# EasyEDA Pro project ProPrj_NavBot-ChargeModule-2S_2026-01-14.epro

# Schematic RECHARGE

## Sheets
1 version: Assembly Variant: Basic; Board Name: RECHARGE; Create Date: 2025-10-13; Page Name: version; Project Name: NavBot-ChargeModule-2S; Schematic Name: RECHARGE; Update Date: 2025-10-13; BladeWidth: 10; Company: NavBot; Drawed: Xioale; Page Size: A4; RegionStart: 1; Reviewed: Xiaole; ShowBorder: 1; TitleBlock: 1; TitleBlockPosition: 3; Version: V1.0; XRegionCount: 6; YRegionCount: 4
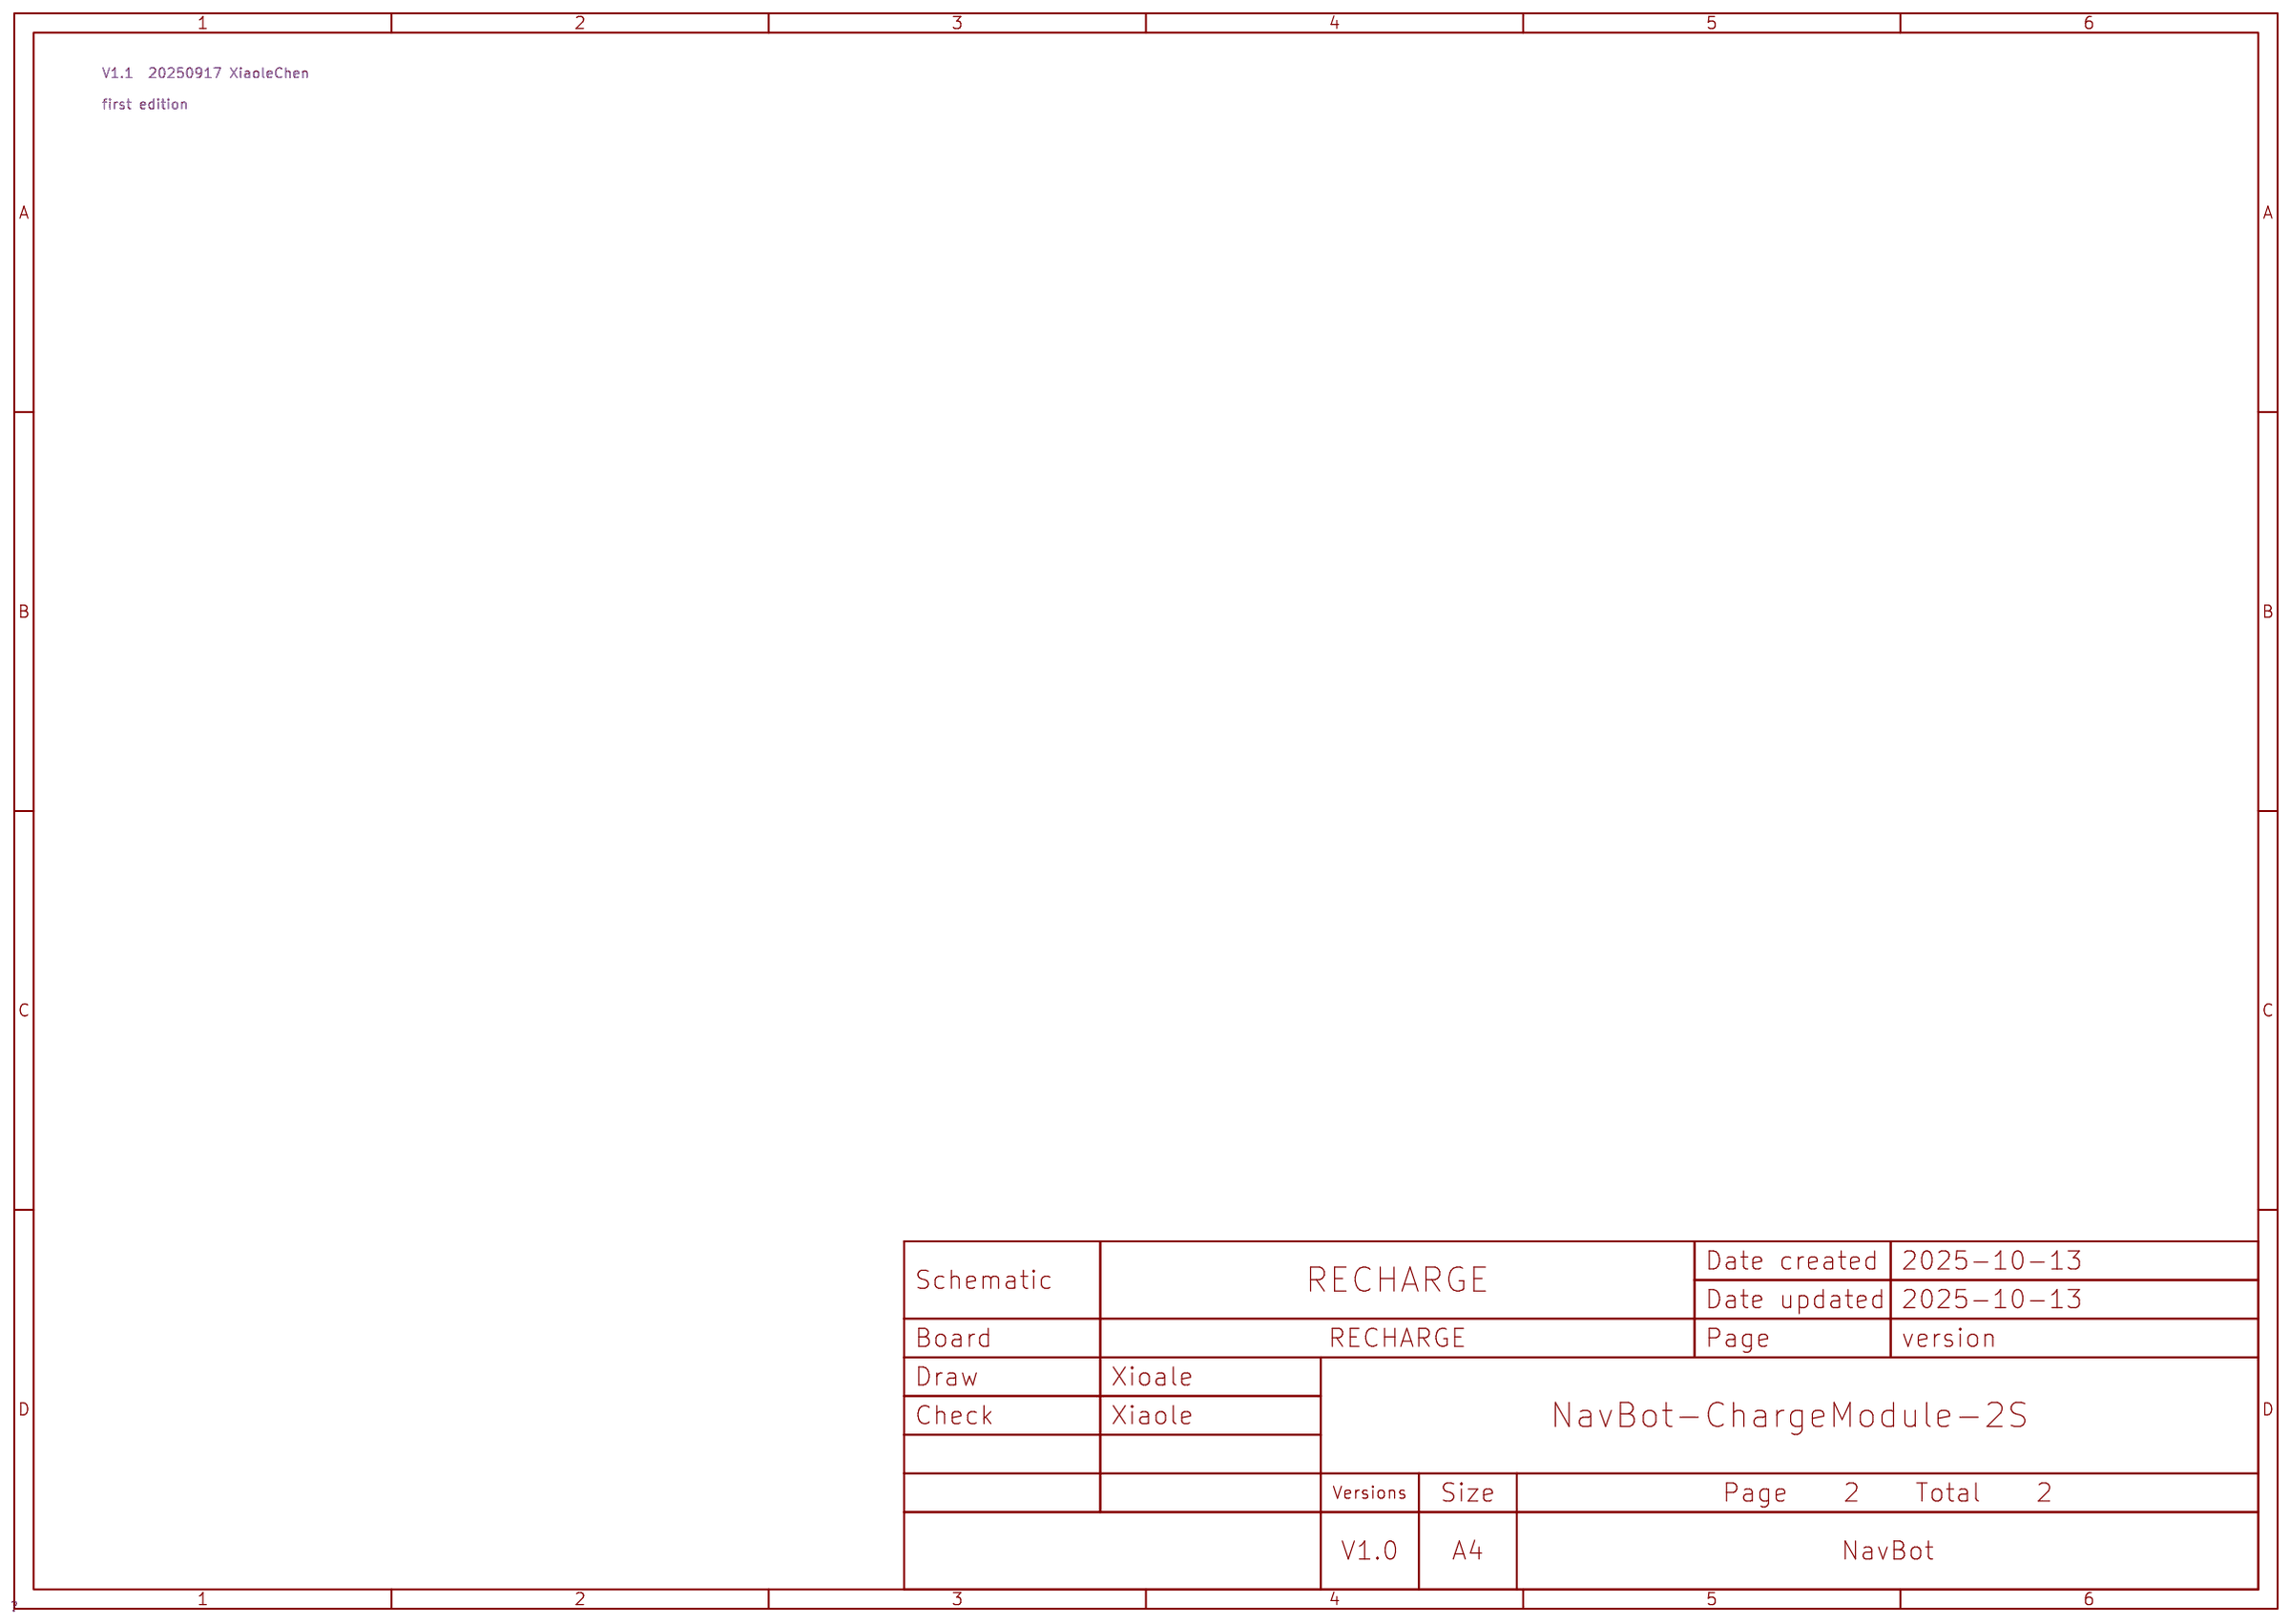
[diagram p0: version]
2 P1: Page Name: P1
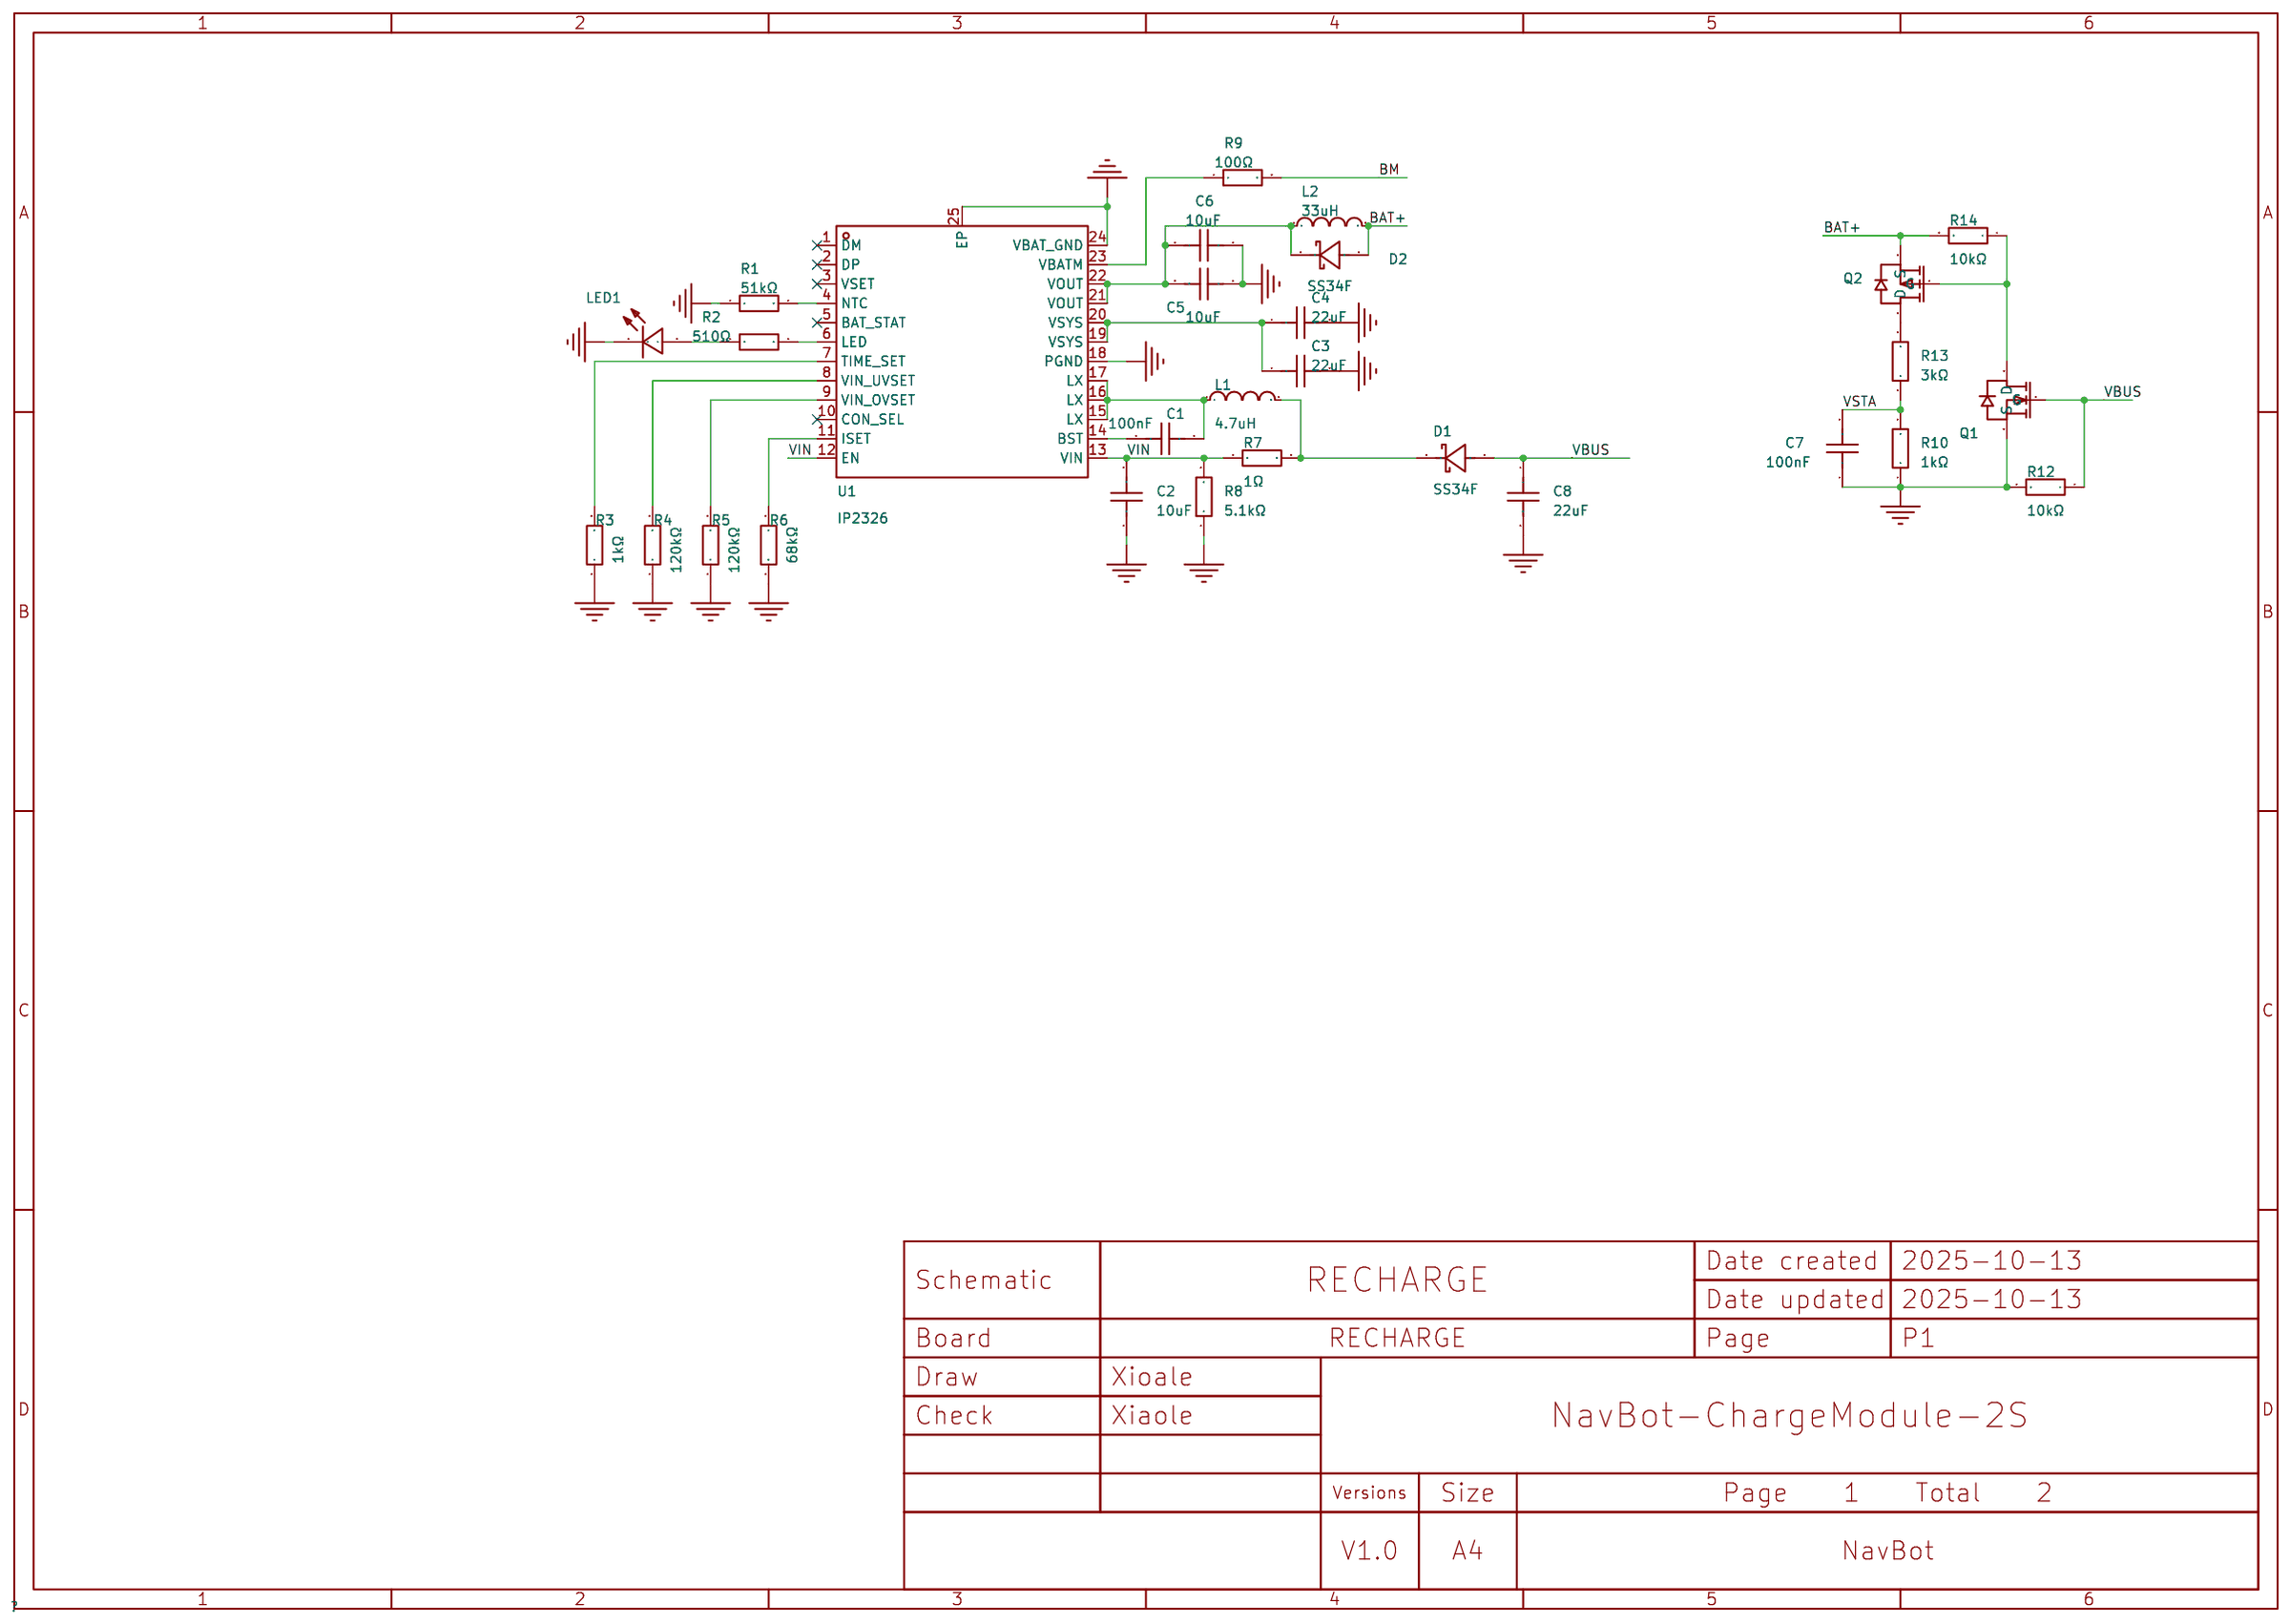
[diagram p1: P1]

## Parts
C1  100nF  [C0603]
C2  10uF  [C0603]
C3  22uF  [C0805]
C4  22uF  [C0805]
C5  10uF  [C0603]
C6  10uF  [C0603]
C7  100nF  [C0603]
C8  22uF  [C0805]
D1  SS34F  [SMAF_L3.5-W2.6-LS4.7-RD-1]
D2  SS34F  [SMAF_L3.5-W2.6-LS4.7-RD-1]
L1  4.7uH  [IND-SMD_L4.0-W4.0]
L2  33uH  [IND-SMD_L4.0-W4.0]
LED1  KT-0603R  [LED0603-RD]
Q1  -  [SOT-23-3_L2.9-W1.3-P1.90-LS2.4-BR]
Q2  -  [AO3401A_SOT-23-3]
R1  51kΩ  [R0603]
R2  510Ω  [R0603]
R3  1kΩ  [R0603]
R4  120kΩ  [R0603]
R5  120kΩ  [R0603]
R6  68kΩ  [R0603]
R7  1Ω  [R0603]
R8  5.1kΩ  [R0603]
R9  100Ω  [R1206]
R10  1kΩ  [R0603]
R12  10kΩ  [R0603]
R13  3kΩ  [R0603]
R14  10kΩ  [R0603]
U1  IP2326  [VQFN-24_L4.0-W4.0-P0.50-BL-EP2.5]

## Library data of the parts
C1 C7 = CC0603KRX7R9BB104: 容值:100nF;精度:±10%;额定电压:50V;材质(温度系数):X7R;; LCSC Part Name: 100nF ±10% 50V; Supplier Part: C14663; Manufacturer: YAGEO(国巨); Supplier Footprint: 0603; JLCPCB Part Class: 基础库; Datasheet: https://atta.szlcsc.com/upload/public/pdf/source/20180910/C282072_33301C7F631E79921B82A8DAC6BCC5B3.pdf; Supplier: LCSC; Tolerance: ±10%; Voltage Rated: 50V; Temperature Coefficient: X7R
C2 C5 C6 = CL10A106MA8NRNC: 容值:10uF;精度:±20%;额定电压:25V;温度系数:X5R;; LCSC Part Name: 10uF ±20% 25V; Supplier Part: C96446; Manufacturer: SAMSUNG(三星); Supplier Footprint: 0603; JLCPCB Part Class: 基础库; Datasheet: https://item.szlcsc.com/datasheet/CL10A106MA8NRNC/97651.html; Supplier: LCSC; Tolerance: ±20%; Voltage Rating: 25V; Temperature Coefficient: X5R
C3 C4 C8 = CL21A226MAQNNNE: 容值:22uF;精度:±20%;额定电压:25V;材质(温度系数):X5R;; LCSC Part Name: 22uF ±20% 25V; Supplier Part: C45783; Manufacturer: SAMSUNG(三星); Supplier Footprint: 0805; JLCPCB Part Class: 基础库; Datasheet: https://atta.szlcsc.com/upload/public/pdf/source/20160218/1457707763339.pdf; Supplier: LCSC; Tolerance: ±20%; Voltage Rated: 25V; Temperature Coefficient: X5R
D1 D2 = SS34F_C18199199: 二极管配置:独立式;正向压降(Vf):550mV@3.0A;直流反向耐压(Vr):40V;整流电流:3A;; LCSC Part Name: 电压:40V 电流:3A; Supplier Part: C18199199; Manufacturer: R+O(宏嘉诚); Supplier Footprint: SMAF; JLCPCB Part Class: 扩展库; Datasheet: https://item.szlcsc.com/datasheet/SS34F/19354431.html; Supplier: LCSC; Diode Configuration: 独立式; Voltage - Forward(Vf@If): 550mV@3.0A; Voltage - DC Reverse(Vr): 40V; Current - Rectified: 3A; Reverse Leakage Current (Ir): 200uA@40V; Operating Junction Temperature Range: -55℃~+125℃; Non-Repetitive Peak Forward Surge Current: 80A
L1 = FHD4012S-4R7MT: 电感值:4.7uH;精度:±20%;额定电流:2.1A;饱和电流(Isat):2.6A;类型:-;; LCSC Part Name: 4.7uH ±20% 2.6A; Supplier Part: C602022; Manufacturer: cjiang(长江微电); Supplier Footprint: SMD,4x4mm; JLCPCB Part Class: 扩展库; Datasheet: https://item.szlcsc.com/datasheet/FHD4012S-4R7MT/631452.html; Supplier: LCSC; Tolerance: ±20%; Current Rating: 2.1A; Current - Saturation(Isat): 2.6A; DC Resistance(DCR): 145mΩ
L2 = FHD4020S-330MT: 电感值:33uH;精度:±20%;额定电流:860mA;饱和电流(Isat):1.4A;类型:绕线电感;; LCSC Part Name: 33uH ±20% 1.4A; Supplier Part: C602034; Manufacturer: cjiang(长江微电); Supplier Footprint: SMD,4x4mm; JLCPCB Part Class: 扩展库; Datasheet: https://atta.szlcsc.com/upload/public/pdf/source/20200609/C601990_BCEA243EC4DA0A9A288AA78A6DFB48A5.pdf; Supplier: LCSC; Tolerance: ±20%; Current Rating: 860mA; Current - Saturation(Isat): 1.4A; DC Resistance(DCR): 650mΩ; Type: 绕线电感
LED1 = KT-0603R: 发光颜色:红色;功率:-;正向电流:-;主波长:-;二极管配置:-;透镜颜色:-;色温:-;发光角度:-;载带方式:-;工作温度:-40℃~+85℃;; LCSC Part Name: 0603 红灯 高亮; Supplier Part: C2286; Manufacturer: KENTO; Supplier Footprint: 0603; JLCPCB Part Class: 基础库; Datasheet: https://atta.szlcsc.com/upload/public/pdf/source/20160616/1466072038404.pdf; Supplier: LCSC; Emitted Color: 红色; Operating Temperature: -40℃~+85℃
Q1 = AO3400A_N: 类型:N沟道;漏源电压(Vdss):30V;连续漏极电流(Id):5.2A;功率(Pd):1W;导通电阻(RDS(on)@Vgs,Id):35mΩ@10V,5A;阈值电压(Vgs(th)@Id):1.5V@250μA;; Supplier Footprint: SOT-23; Supplier Part: C700953
Q2 = AO3401A_P: Supplier Footprint: SOT-23-3L; Supplier Part: C15127
R1 = 0603WAF5102T5E: 电阻类型:厚膜电阻;阻值:51kΩ;精度:±1%;功率:100mW;最大工作电压:75V;温度系数:±100ppm/℃;; LCSC Part Name: 51kΩ ±1% 100mW 厚膜电阻; Supplier Part: C23196; Manufacturer: UNI-ROYAL(厚声); Supplier Footprint: 0603; JLCPCB Part Class: 基础库; Datasheet: https://atta.szlcsc.com/upload/public/pdf/source/20200306/C422600_1E6D84923E4A46A82E41ADD87F860B5C.pdf; Supplier: LCSC; Type: 厚膜电阻; Tolerance: ±1%; Power(Watts): 100mW; Overload Voltage (Max): 75V; Temperature Coefficient: ±100ppm/℃; Operating Temperature Range: -55℃~+155℃
R2 = 0603WAF5100T5E: 电阻类型:厚膜电阻;阻值:510Ω;精度:±1%;功率:100mW;工作电压:75V;温度系数:±100ppm/℃;; LCSC Part Name: 510Ω ±1% 100mW 厚膜电阻; Supplier Part: C23193; Manufacturer: UNI-ROYAL(厚声); Supplier Footprint: 0603; JLCPCB Part Class: 基础库; Datasheet: https://item.szlcsc.com/datasheet/0603WAF5100T5E/23920.html; Supplier: LCSC; Type: 厚膜电阻; Tolerance: ±1%; Power(Watts): 100mW; Voltage-Supply(Max): 75V; Temperature Coefficient: ±100ppm/℃; Operating Temperature: -55℃~+155℃
R3 R10 = 0603WAF1001T5E: 电阻类型:厚膜电阻;阻值:1kΩ;精度:±1%;功率:100mW;最大工作电压:75V;温度系数:±100ppm/℃;; LCSC Part Name: 1kΩ ±1% 100mW 厚膜电阻; Supplier Part: C21190; Manufacturer: UNI-ROYAL(厚声); Supplier Footprint: 0603; JLCPCB Part Class: 基础库; Datasheet: https://atta.szlcsc.com/upload/public/pdf/source/20200306/C422600_1E6D84923E4A46A82E41ADD87F860B5C.pdf; Supplier: LCSC; Type: 厚膜电阻; Tolerance: ±1%; Power(Watts): 100mW; Overload Voltage (Max): 75V; Temperature Coefficient: ±100ppm/℃; Operating Temperature Range: -55℃~+155℃
R4 R5 = 0603WAF1203T5E: 电阻类型:厚膜电阻;阻值:120kΩ;精度:±1%;功率:100mW;工作电压:75V;温度系数:±100ppm/℃;; LCSC Part Name: 120kΩ ±1% 100mW 厚膜电阻; Supplier Part: C25808; Manufacturer: UNI-ROYAL(厚声); Supplier Footprint: 0603; JLCPCB Part Class: 基础库; Datasheet: https://item.szlcsc.com/datasheet/0603WAF1203T5E/26551.html; Supplier: LCSC; Type: 厚膜电阻; Tolerance: ±1%; Power(Watts): 100mW; Voltage-Supply(Max): 75V; Temperature Coefficient: ±100ppm/℃; Operating Temperature: -55℃~+155℃
R6 = 0603WAF6802T5E: 电阻类型:厚膜电阻;阻值:68kΩ;精度:±1%;功率:100mW;工作电压:75V;温度系数:±100ppm/℃;; LCSC Part Name: 68kΩ ±1% 100mW 厚膜电阻; Supplier Part: C23231; Manufacturer: UNI-ROYAL(厚声); Supplier Footprint: 0603; JLCPCB Part Class: 基础库; Datasheet: https://item.szlcsc.com/datasheet/0603WAF6802T5E/23958.html; Supplier: LCSC; Type: 厚膜电阻; Tolerance: ±1%; Power(Watts): 100mW; Voltage-Supply(Max): 75V; Temperature Coefficient: ±100ppm/℃; Operating Temperature: -55℃~+155℃
R7 = 0603WAF100KT5E: 电阻类型:厚膜电阻;阻值:1Ω;精度:±1%;功率:100mW;工作电压:75V;温度系数:±400ppm/℃;; LCSC Part Name: 1Ω ±1% 100mW 厚膜电阻; Supplier Part: C22936; Manufacturer: UNI-ROYAL(厚声); Supplier Footprint: 0603; JLCPCB Part Class: 基础库; Datasheet: https://item.szlcsc.com/datasheet/0603WAF100KT5E/23663.html; Supplier: LCSC; Type: 厚膜电阻; Tolerance: ±1%; Power(Watts): 100mW; Voltage-Supply(Max): 75V; Temperature Coefficient: ±400ppm/℃; Operating Temperature: -55℃~+155℃
R8 = 0603WAF5101T5E: 电阻类型:厚膜电阻;阻值:5.1kΩ;精度:±1%;功率:100mW;最大工作电压:75V;温度系数:±100ppm/℃;; LCSC Part Name: 5.1kΩ ±1% 100mW 厚膜电阻; Supplier Part: C23186; Manufacturer: UNI-ROYAL(厚声); Supplier Footprint: 0603; JLCPCB Part Class: 基础库; Datasheet: https://atta.szlcsc.com/upload/public/pdf/source/20200306/C422600_1E6D84923E4A46A82E41ADD87F860B5C.pdf; Supplier: LCSC; Type: 厚膜电阻; Tolerance: ±1%; Power(Watts): 100mW; Overload Voltage (Max): 75V; Temperature Coefficient: ±100ppm/℃; Operating Temperature Range: -55℃~+155℃
R9 = 1206W4F1000T5E: 电阻类型:厚膜电阻;阻值:100Ω;精度:±1%;功率:250mW;工作电压:200V;温度系数:±100ppm/℃;; LCSC Part Name: 100Ω ±1% 250mW 厚膜电阻; Supplier Part: C17901; Manufacturer: UNI-ROYAL(厚声); Supplier Footprint: 1206; JLCPCB Part Class: 基础库; Datasheet: https://item.szlcsc.com/datasheet/1206W4F1000T5E/18589.html; Supplier: LCSC; Type: 厚膜电阻; Tolerance: ±1%; Power(Watts): 250mW; Voltage-Supply(Max): 200V; Temperature Coefficient: ±100ppm/℃; Operating Temperature: -55℃~+155℃
R12 R14 = 0603WAF1002T5E: 电阻类型:厚膜电阻;阻值:10kΩ;精度:±1%;功率:100mW;最大工作电压:75V;温度系数:±100ppm/℃;; LCSC Part Name: 厚膜电阻 10kΩ ±1% 100mW; Supplier Part: C25804; Manufacturer: UNI-ROYAL(厚声); Supplier Footprint: 0603; JLCPCB Part Class: 基础库; Datasheet: https://atta.szlcsc.com/upload/public/pdf/source/20200306/C422600_1E6D84923E4A46A82E41ADD87F860B5C.pdf; Supplier: LCSC; Type: 厚膜电阻; Tolerance: ±1%; Power(Watts): 100mW; Overload Voltage (Max): 75V; Temperature Coefficient: ±100ppm/℃; Operating Temperature Range: -55℃~+155℃
R13 = 0603WAF3001T5E: 电阻类型:厚膜电阻;阻值:3kΩ;精度:±1%;功率:100mW;工作电压:75V;温度系数:±100ppm/℃;; LCSC Part Name: 3kΩ ±1% 100mW 厚膜电阻; Supplier Part: C4211; Manufacturer: UNI-ROYAL(厚声); Supplier Footprint: 0603; JLCPCB Part Class: 基础库; Datasheet: https://atta.szlcsc.com/upload/public/pdf/source/20200306/C422600_1E6D84923E4A46A82E41ADD87F860B5C.pdf; Supplier: LCSC; Type: 厚膜电阻; Tolerance: ±1%; Power(Watts): 100mW; Voltage-Supply(Max): 75V; Temperature Coefficient: ±100ppm/℃; Operating Temperature: -55℃~+155℃
U1 = IP2326: 工作电压:4.5V~9.5V;最大充电电流:1.5A;电池类型:锂离子/聚合物;电池节数:2~3;; LCSC Part Name: 支持15W快充的2节/3节串联锂电池升压充电IC; Supplier Part: C2832094; Manufacturer: INJOINIC(英集芯); Supplier Footprint: VQFN-24-EP(4x4); JLCPCB Part Class: 扩展库; Datasheet: https://item.szlcsc.com/datasheet/IP2326/2988389.html; Supplier: LCSC; The Chip Type: 充电芯片；均衡芯片; Voltage - Supply: 4.5V~9.5V; Charge Current - Max: 1.5A; Charging Saturation Voltage: 8.4V; Type of Battery: 锂离子/聚合物; Number of Cells: 2~3; Operating Temperature: -40℃~+150℃; Battery Temperature Detection: 支持; Supply Current (Iq): 700nA

## Nets
GND: C2.1 C3.2 C4.2 C5.1 C6.1 C7.1 C8.2 LED1.1(K) Q1.2(S) R1.1 R3.1 R4.1 R5.1 R6.1 R8.1 R10.1 R12.2 U1.18(PGND) U1.24(VBAT_GND) U1.25(EP)
VBUS: C8.1 D1.2(A) Q1.1(G) R12.1
VIN: C2.2 R7.1 R8.2 U1.12(EN) U1.13(VIN)
BAT+: D2.2(A) L2.2 Q2.2(S) R14.2
BM: R9.2
VSTA: C7.2 R10.2 R13.1
$1N556: R1.2 U1.4(NTC)
$1N752: R2.2 U1.6(LED)
$1N756: LED1.2(A) R2.1
$1N853: R3.2 U1.7(TIME_SET)
$1N895: R4.2 U1.8(VIN_UVSET)
$1N1011: R5.2 U1.9(VIN_OVSET)
$1N1091: R6.2 U1.11(ISET)
$1N1187: D1.1(K) L1.2 R7.2
$1N1196: C1.2 L1.1 U1.15(LX) U1.16(LX) U1.17(LX)
$1N1270: C1.1 U1.14(BST)
$1N1671: C3.1 C4.1 U1.19(VSYS) U1.20(VSYS)
$1N1854: C5.2 C6.2 D2.1(K) L2.1 U1.21(VOUT) U1.22(VOUT)
$1N2358: R9.1 U1.23(VBATM)
$1N3338: Q1.3(D) Q2.1(G) R14.1
$1N3747: Q2.3(D) R13.2

Not connected (* = marked no-connect by the designer): U1 1(DM)* 2(DP)* 3(VSET)* 5(BAT_STAT)* 10(CON_SEL)*

## Notes on the sheets
sheet 1
- V1.1  20250917 XiaoleChen
  first edition

# Board RECHARGE
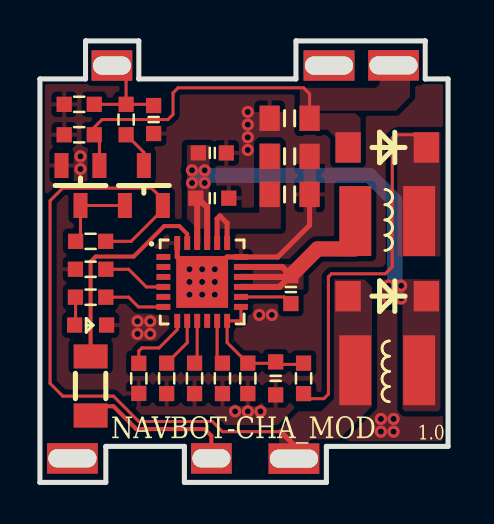
[diagram p2: board, top side]
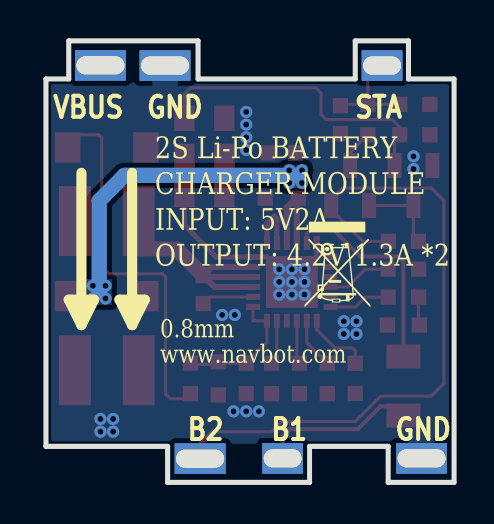
[diagram p3: board, bottom side, seen from below]

Outline 20.45 x 22.1 mm; copper layers: Top Layer, Bottom Layer. Coordinates in mm from the lower left corner of the outline.
Outline path: 0,20.19 0,0 3.3,0 3.3,1.8 7.24,1.8 7.24,0 14.35,0 14.35,1.8 20.45,1.8 20.45,20.19 19.3,20.19 19.3,22.1 12.83,22.1 12.83,20.19 4.95,20.19 4.95,22.1 2.29,22.1 2.29,20.19 0,20.19
Stack: Top Layer 0.035mm / Dielectric1 0.71mm FR4 er 4.5 / Bottom Layer 0.035mm

## Design rules (mm)
spacing copperThickness1oz (default): track to track 0.102, other pairs 0 to 0.203
spacing copperThickness2oz: track to track 0.203, other pairs 0.127 to 0.3
spacing Plane_innerPlane: track to track 0.102, other pairs 0 to 0.203
spacing Copper_copperRegion: track to track 0.102, other pairs 0 to 0.203
track width copperThickness1oz (default): min 0.127, default 0.254, max 2.54
track width copperThickness2oz: min 0.203, default 0.254, max 2.54
differential pair differentialPair (default): width min 0.127, default 0.254, max 2.54; gap min 0.152, default 0.152
pour e194 uses Copper_copperRegion
pour e240 uses Copper_copperRegion

## Placement (name value [footprint] x y rotation side)
C1  100nF  [C0603]  12.57 9.65 90 top
C2  10uF  [C0603#2]  11.81 5.21 90 top
C3  22uF  [C0805]  12.51 14.41 0 top
C4  22uF  [C0805]  12.51 16.32 0 top
C5  10uF  [C0603]  8.64 16.51 180 top
C6  10uF  [C0603#2]  8.64 14.22 180 top
C7  100nF  [C0603]  5.72 18.16 90 top
C8  22uF  [C0805]  12.51 18.22 180 top
D1  SS34F  [SMAF_L3.5-W2.6-LS4.7-RD-1]  17.4 16.76 180 top
D2  SS34F  [SMAF_L3.5-W2.6-LS4.7-RD-1]  17.4 9.32 180 top
L1  4.7uH  [IND-SMD_L4.0-W4.0]  17.4 13.08 0 top
L2  33uH  [IND-SMD_L4.0-W4.0]  17.4 5.61 180 top
LED1  KT-0603R  [LED0603-RD]  2.54 7.87 180 top
NOREF  -  [Pad_e47]  17.71 20.87 0 top
NOREF#2  -  [Pad_e40]  12.72 1.19 180 top
NOREF#3  -  [Pad_e44]  1.63 1.2 180 top
NOREF#4  -  [Pad_e42]  1.63 1.2 180 top
NOREF#5  -  [Pad_e37]  3.61 20.86 180 top
NOREF#6  -  [Pad_e45]  3.61 20.86 0 top
NOREF#7  -  [Pad_e48]  12.72 1.19 180 top
NOREF#8  -  [Pad_e41]  8.59 1.2 180 top
NOREF#9  -  [Pad_e46]  14.48 20.86 0 top
NOREF#10  -  [Pad_e38]  14.48 20.86 180 top
NOREF#11  -  [Pad_e43]  8.59 1.2 180 top
NOREF#12  -  [Pad_e39]  17.71 20.87 180 top
Q1  -  [SOT-23-3_L2.9-W1.3-P1.90-LS2.4-BR]  2.03 14.86 90 top
Q2  -  [AO3401A_SOT-23-3]  5.21 14.86 270 top
R1  51kΩ  [R0603]  2.54 10.67 0 top
R2  510Ω  [R0603]  2.54 9.27 0 top
R3  1kΩ  [R0603]  4.95 5.21 90 top
R4  120kΩ  [R0603]  6.35 5.21 90 top
R5  120kΩ  [R0603]  7.75 5.21 90 top
R6  68kΩ  [R0603]  9.14 5.21 90 top
R7  1Ω  [R0603]  13.21 5.21 270 top
R8  5.1kΩ  [R0603]  10.41 5.21 90 top
R9  100Ω  [R1206]  2.54 4.83 270 top
R10  1kΩ  [R0603]  1.97 18.92 0 top
R12  10kΩ  [R0603]  1.97 17.4 180 top
R13  3kΩ  [R0603]  4.32 18.16 270 top
R14  10kΩ  [R0603]  2.54 12.06 0 top
U1  IP2326  [VQFN-24_L4.0-W4.0-P0.50-BL-EP2.5]  8.13 10.03 270 top

## Footprints (pads in the part's own frame, mm; a bottom-side part is the same pattern mirrored in y, then rotated)
AO3401A_SOT-23-3
  rect 1.25x0.7 smd: 1(1,-0.95) 2(1,0.95) 3(-1,0)
C0603
  rect 0.762x0.762 smd: 1(-0.7,0.019) 2(0.7,0.019)
C0603#2
  rect 0.762x0.762 smd: 1(-0.827,0) 2(0.827,0)
C0805
  rect 1.016x1.27 smd: 1(-1,0) 2(1,0)
IND-SMD_L4.0-W4.0
  rect 1.6x3.5 smd: 1(-1.6,0) 2(1.6,0)
LED0603-RD
  rect 0.762x0.762 smd: 1(-0.799,0) 2(0.799,0)
Pad_e37
  rect 2.032x1.5 smd far side: 1(0,0)
Pad_e38
  rect 2.54x1.5 smd far side: 1(0,0)
Pad_e39
  rect 2.54x1.5 smd far side: 1(0,0)
Pad_e40
  rect 2.54x1.5 smd far side: 1(0,0)
Pad_e41
  rect 2.032x1.5 smd far side: 1(0,0)
Pad_e42
  rect 2.54x1.5 smd far side: 1(0,0)
Pad_e43
  rect 2.032x1.524 hole 1.905x0.914: 1(0,0)
Pad_e44
  rect 2.54x1.524 hole 2.413x0.914: 1(0,0)
Pad_e45
  rect 2.032x1.524 hole 1.905x0.914: 1(0,0)
Pad_e46
  rect 2.54x1.524 hole 2.413x0.914: 1(0,0)
Pad_e47
  rect 2.54x1.524 hole 2.413x0.914: 1(0,0)
Pad_e48
  rect 2.54x1.524 hole 2.413x0.914: 1(0,0)
R0603
  rect 0.762x0.762 smd: 1(-0.753,0) 2(0.753,0)
R1206
  rect 1.208x1.701 smd: 1(-1.479,0) 2(1.479,0)
SMAF_L3.5-W2.6-LS4.7-RD-1
  rect 1.27x1.524 smd: 1(-1.96,0) 2(1.96,0)
SOT-23-3_L2.9-W1.3-P1.90-LS2.4-BR
  rect 1.25x0.7 smd: 1(1,-0.95) 2(1,0.95) 3(-1,0)
VQFN-24_L4.0-W4.0-P0.50-BL-EP2.5
  rect 0.3x0.7 smd: 1(-1.25,-1.942) 2(-0.75,-1.942) 3(-0.25,-1.942) 4(0.25,-1.942) 5(0.75,-1.942) 6(1.25,-1.942) 13(1.25,1.942) 14(0.75,1.942) 15(0.25,1.942) 16(-0.25,1.942) 17(-0.75,1.942) 18(-1.25,1.942)
  rect 0.7x0.3 smd: 7(1.948,-1.25) 8(1.948,-0.75) 9(1.948,-0.25) 10(1.948,0.25) 11(1.948,0.75) 12(1.948,1.25) 19(-1.948,1.25) 20(-1.948,0.75) 21(-1.948,0.25) 22(-1.948,-0.25) 23(-1.948,-0.75) 24(-1.948,-1.25)
  rect 2.6x2.6 smd: 25(0.001,-0.001)

## Nets
GND: C2.1 C3.2 C4.2 C5.1 C6.1 C7.1 C8.2 LED1.1 NOREF#3.1 NOREF#4.1 NOREF#9.1 NOREF#10.1 Q1.2 R1.1 R3.1 R4.1 R5.1 R6.1 R8.1 R10.1 R12.2 U1.18 U1.24 U1.25
VBUS: C8.1 D1.2 NOREF.1 NOREF#12.1 Q1.1 R12.1
VIN: C2.2 R7.1 R8.2 U1.12 U1.13
BAT+: D2.2 L2.2 NOREF#2.1 NOREF#7.1 Q2.2 R14.2
BM: NOREF#8.1 NOREF#11.1 R9.2
VSTA: C7.2 NOREF#5.1 NOREF#6.1 R10.2 R13.1
$1N556: R1.2 U1.4
$1N752: R2.2 U1.6
$1N756: LED1.2 R2.1
$1N853: R3.2 U1.7
$1N895: R4.2 U1.8
$1N1011: R5.2 U1.9
$1N1091: R6.2 U1.11
$1N1187: D1.1 L1.2 R7.2
$1N1196: C1.2 L1.1 U1.15 U1.16 U1.17
$1N1270: C1.1 U1.14
$1N1671: C3.1 C4.1 U1.19 U1.20
$1N1854: C5.2 C6.2 D2.1 L2.1 U1.21 U1.22
$1N2358: R9.1 U1.23
$1N3338: Q1.3 Q2.1 R14.1
$1N3747: Q2.3 R13.2

Pads without a net: U1 1 2 3 5 10

## Via types
v1: diameter 0.61, hole 0.305, Top Layer to Bottom Layer, 36 vias

## Routing (per net, layer and track width the routed paths; a pad name or vN(x,y) marks a point on that pad's centre or on a via; arc(x,y) is an arc through that point)
GND: length 10.6
  Top Layer w0.254: C3.2 13.51,12.87 11.92,11.28 U1.18 9.38,11.28 v1(8.76,10.67) 8.25,10.16 8.13,10.16 ; 8.13,10.16 v1(8.13,10.03) ; 8.13,10.16 8,10.16 v1(7.49,10.67) 6.88,11.28 U1.24
  vias: v1(2.03,16.32) v1(2.03,15.68) v1(4.89,8.06) v1(4.89,7.43) v1(5.52,8.06) v1(5.52,7.43) v1(7.49,10.03) v1(7.49,9.4) v1(8.13,10.67) v1(8.13,9.4) v1(8.76,10.03) v1(8.76,9.4) v1(9.78,3.56) v1(10.41,18.54) v1(10.41,17.91) v1(10.41,17.27) v1(10.41,16.64) v1(10.41,3.56) v1(10.99,8.38) v1(11.05,3.56) v1(11.62,8.38) v1(17.08,3.17) v1(17.08,2.54) v1(17.72,3.17) v1(17.72,2.54)
VBUS: length 15.6
  Top Layer w0.152: C8.1 13.51,19.45 13.21,19.75 6.92,19.75 6.67,19.49 6.67,18.42 6.41,18.16 3.11,18.16 2.72,17.77 R12.1 2.98,17.14 Q1.1
VIN: length 6.8
  Top Layer w0.152: U1.13 10.07,8.09 U1.12 9.38,7 10.41,5.96 11.74,5.96 11.79,5.91 13.15,5.91 13.21,5.96
BAT+: length 33.5
  Top Layer w0.152: R14.2 4.57,12.06 6.16,13.65 Q2.2 6.16,14.16 5.59,14.73 1.14,14.73 0.51,14.1 0.51,4.95 1.14,4.32 3.68,4.32 4.95,3.05 8.64,3.05 9.14,2.54 12.07,2.54
  Top Layer w0.254: 12.07,2.54 12.72,1.88 NOREF#2.1
BM: length 8
  Top Layer w0.203: NOREF#8.1 8.59,2.33 8.26,2.67 4.83,2.67 3.68,3.81 3,3.81 R9.2
VSTA: length 5.2
  Top Layer w0.152: C7.2 5.63,18.92 R13.1 ; R13.1 R10.2 ; R13.1 4.32,20.16 NOREF#5.1
$1N556: length 3.3
  Top Layer w0.152: 3.29,10.67 4.45,10.67 5.33,9.78 U1.4
$1N752: length 3.1
  Top Layer w0.152: 3.29,9.27 4.45,9.27 4.93,8.78 U1.6
$1N756: length 1.4
  Top Layer w0.152: LED1.2 1.79,7.92 1.79,9.27
$1N853: length 3.4
  Top Layer w0.152: U1.7 6.88,7.64 5.97,6.73 5.11,6.73 4.95,6.58 R3.2
$1N895: length 2.6
  Top Layer w0.152: U1.8 7.38,6.99 6.35,5.96
$1N1011: length 2.2
  Top Layer w0.152: U1.9 7.88,6.09 7.75,5.96
$1N1091: length 2.2
  Top Layer w0.152: U1.11 8.88,6.23 9.14,5.96
$1N1187: length 19.2
  Top Layer w0.152: 13.21,4.45 13.47,4.19 14.22,4.19 14.45,4.42 14.45,10.29 14.61,10.44 17.3,10.44 17.65,10.8 17.65,17.25 17.81,17.4 18.72,17.4 D1.1
$1N1196: length 11.5
  Top Layer w0.305: U1.17 12.14,10.78 C1.2 ; U1.15 12,9.78 12.5,10.28 U1.16
  Top Layer w0.762: C1.2 13.91,11.68 15.8,11.68
$1N1270: length 2.6
  Top Layer w0.152: U1.14 12.24,9.28 C1.1
$1N1671: length 2.9
  Top Layer w0.254: U1.20 8.88,13.2 9.02,13.34 9.38,12.97 U1.19
$1N1854: length 19.7
  Top Layer w0.305: U1.21 8.38,13.76 7.94,14.2 7.88,14.15 U1.22
  Bottom Layer w0.762: 7.87,15.37 16.51,15.37 17.78,14.1 17.78,9.53
  vias: v1(7.62,15.62) v1(7.62,14.99) v1(8.26,15.62) v1(8.26,14.99) v1(17.46,9.84) v1(17.46,9.21) v1(18.1,9.84) v1(18.1,9.21)
$1N2358: length 10.9
  Top Layer w0.203: R9.1 2.54,11.05 2.79,11.3 4.7,11.3 6.22,12.83 6.99,12.83 7.38,12.43 U1.23
$1N3338: length 4.1
  Top Layer w0.152: 4.26,13.86 Q1.3 2.03,12.31 R14.1
$1N3747: length 1.9
  Top Layer w0.152: Q2.3 5.21,16.52 4.32,17.41

## Copper pours and planes (outline as drawn; the poured copper is in the pictures)
GND on Top Layer: 12.57,16.76 14.41,16.76 14.41,16 12.57,16
GND on Top Layer: 12.57,17.34 14.41,17.34 14.41,15.94 12.57,15.94
GND on Top Layer: 13.21,17.4 13.84,17.4 13.84,12.95 13.21,12.95
GND on Top Layer: -0.76,22.61 19.69,22.61 21.72,20.57 21.72,1.78 20.32,0.38 -0.38,0.38 -0.76,0.76
GND on Top Layer: 10.41,18.54 12.45,18.54 12.45,17.27 10.41,17.27
GND on Bottom Layer: 1.02,2.67 2.29,2.67 2.29,1.4 1.02,1.4
GND on Bottom Layer: -0.38,20.45 20.45,20.45 20.45,1.8 -0.13,1.8 -0.38,2.05
GND on Bottom Layer: 13.85,20.63 15.12,20.63 15.12,19.36 13.85,19.36
VBUS on Top Layer: 13.02,20.7 18.54,20.7 18.54,17.02 13.02,17.02
BAT+ on Top Layer: 11.98,10.16 16.64,10.16 16.64,1.19 11.98,1.19
$1N1187 on Top Layer: 17.91,17.53 20.07,17.53 20.07,11.3 17.91,11.3
$1N1196 on Top Layer: 10.67,10.92 13.21,10.92 13.21,9.65 10.67,9.65
$1N1671 on Top Layer: 10.99,16.95 12.07,16.95 12.07,13.08 10.99,13.08
$1N1671 on Top Layer: 8.92,13.5 12.07,13.5 12.07,12.7 8.92,12.7
$1N1854 on Top Layer: 18.16,10.16 20.07,10.16 20.07,3.56 18.16,3.56
$1N1854 on Top Layer: 17.15,10.16 19.05,10.16 19.05,8.89 17.15,8.89
$1N1854 on Top Layer: 7.37,16.89 8.51,16.89 8.51,12.69 7.37,12.69
$1N1854 on Bottom Layer: 17.15,10.16 18.41,10.16 18.41,8.89 17.15,8.89
$1N1854 on Bottom Layer: 7.37,15.88 8.51,15.88 8.51,14.73 7.37,14.73

## Text on the board
Bottom Silkscreen Layer: GND | STA | B1 | B2 | VBUS | 0.8mm | www.navbot.com | 2S Li-Po BATTERY / CHARGER MODULE / INPUT: 5V2A / OUTPUT: 4.2V 1.3A *2
Top Silkscreen Layer: 1.0 | NAVBOT-CHA_MOD
